# EAGLE design ESP12E BMS (EAGLE 9.6.2)
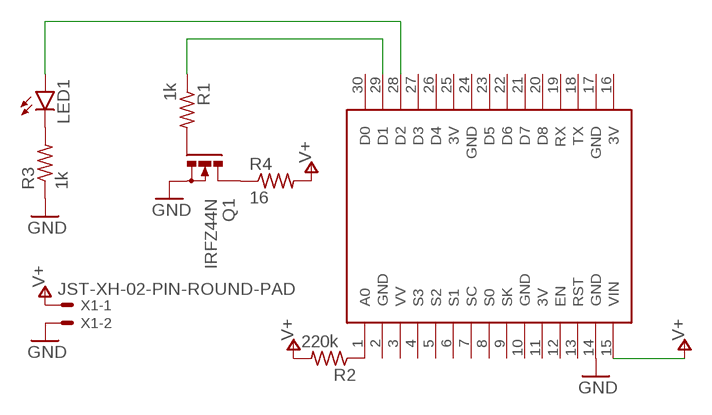
[diagram p0: schematic, sheet 1]

## Parts
LED1  TLLR4400  [LED3MM]
Q1  IRFZ44N  PMOSFET_NTO220BH  [TO220BH]
R1  1k  R-US_0204/7  [0204/7]
R2  220k  R-US_0204/7  [0204/7]
R3  1k  R-US_0204/7  [0204/7]
R4  16  R-US_0613/15  [P0613/15]
U$1  NODEMCU  [NODEMCU]
X1  JST-XH-02-PIN-ROUND-PAD  [JST-XH-02-PACKAGE-ROUND-PAD]

## Nets
GND: Q1.S R3.1 U$1.14(GND) X1.2
N$1: LED1.K(C) R3.2
N$2: Q1.G R1.2
N$3: Q1.D R4.1
N$4: R1.1 U$1.29(D1)
N$5: LED1.A U$1.28(D2)
N$6: R2.1 U$1.1(A0)
V+: R2.2 R4.2 U$1.15(VIN) X1.1
Unconnected: U$1.3(VV) U$1.4(S3) U$1.5(S2) U$1.6(S1) U$1.7(SC) U$1.8(S0) U$1.9(SK) U$1.12(EN) U$1.13(RST) U$1.18(TX) U$1.19(RX) U$1.20(D8) U$1.21(D7) U$1.22(D6) U$1.23(D5) U$1.26(D4) U$1.27(D3) U$1.30(D0)

## Power pins joined to a net without a drawn wire
3V: U$1.11(3V) U$1.16(3V) U$1.25(3V)
GND: U$1.2(GND) U$1.10(GND) U$1.17(GND) U$1.24(GND)

## Library data of the parts
LED1 = led:TLLR4400: Low Current (2mA) LED 3 mm Tinted Diffused Package color RED Source: Data sheet <http://www.farnell.com/datasheets/391100.pdf>; MF: VISHAY SEMICONDUCTOR; OC_FARNELL: 1612437
Q1 = transistor-power:PMOSFET_N: Power MOSFET N-Channel
R1-R4 = rcl:R-US_: RESISTOR, American symbol; SPICEPREFIX: R
U$1 = nodemcu:NODEMCU
X1 = Rembrandt Electronics - JST XH Connectors v1-0:JST-XH-02-PIN: JST XH Connector 2 Pin Wire to board connector. Pitch: 2,54 mm, (0.100") Number of pins: 2 Created by Rembrandt Electronics www.rembrandtelectronics.com

## Board
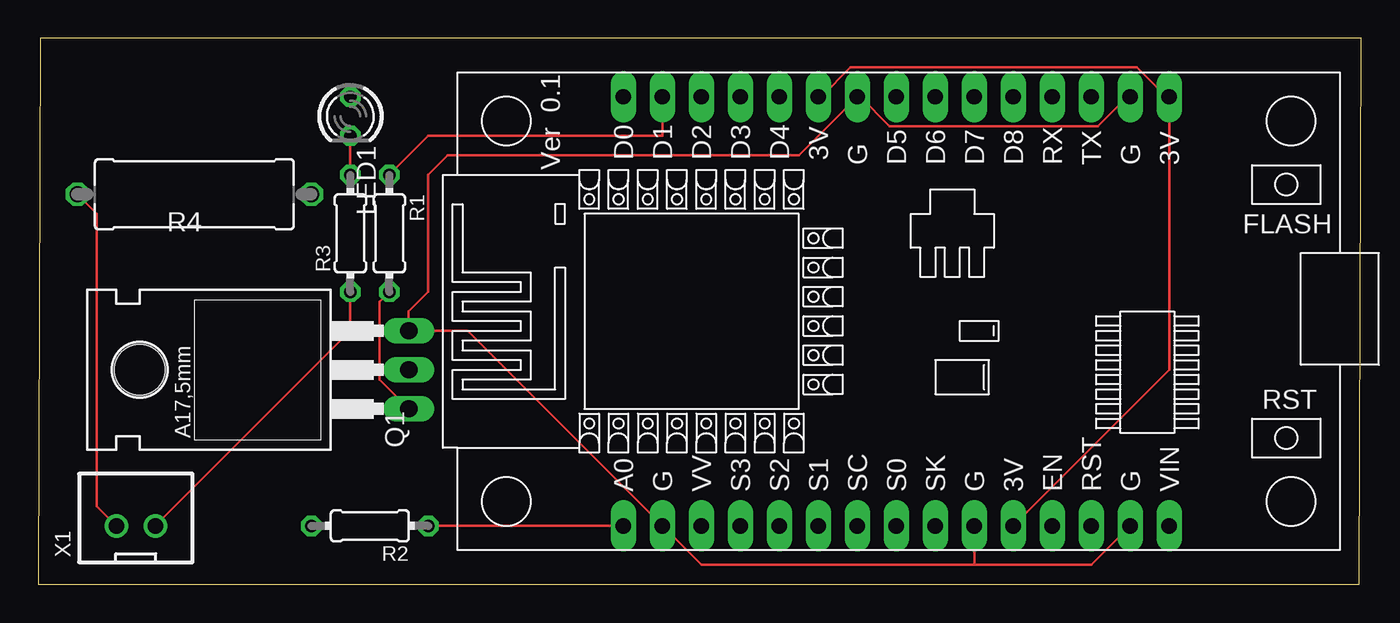
[diagram p1: board, top side]
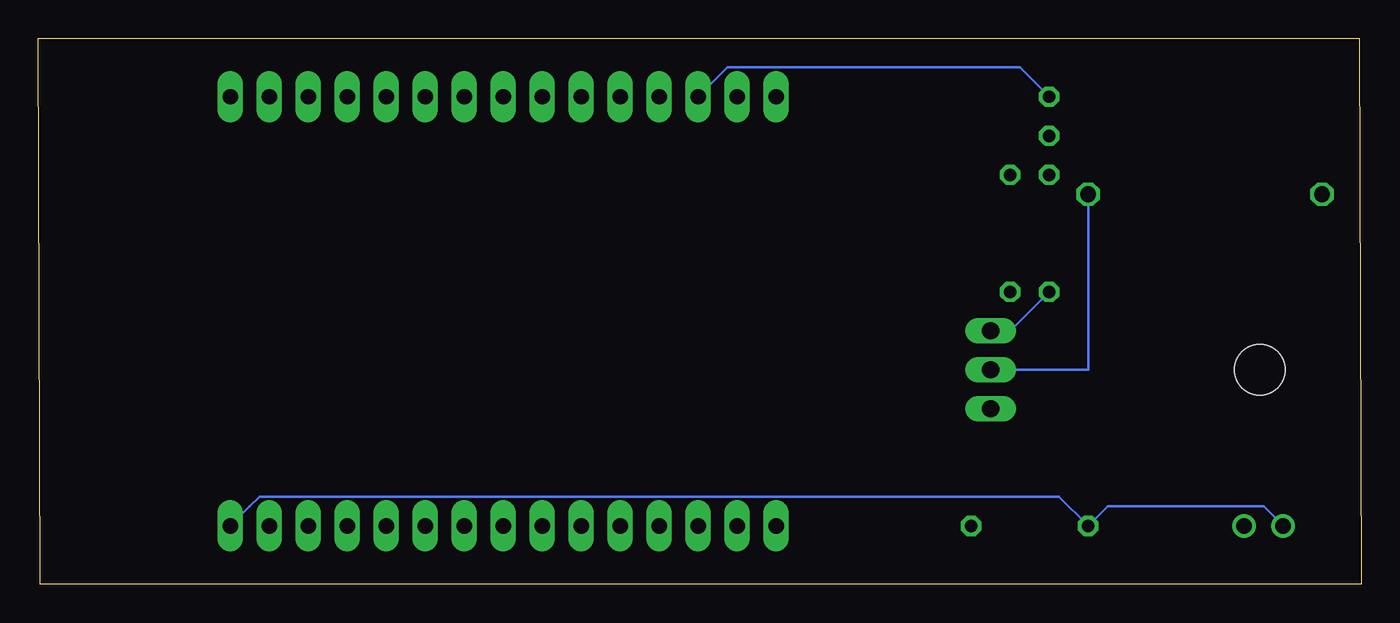
[diagram p2: board, bottom side, seen from below]

Size 86.16 x 35.55 mm. Coordinates in mm from the lower left corner, seen from the top.
Outline: 0,0 86.03,0 86.16,35.55 0.13,35.55 0,0
Copper layers (1*16): Top 0.035mm / dielectric 1.5mm / Bottom 0.035mm
Design rules "default": minimum track width 6mil, minimum drill 0.35mm, track to track 6mil, track to pad 6mil, pad to pad 6mil, via to via 6mil, smd to smd 6mil, copper to edge 40mil, drill to drill 6mil, minimum pad ring 10mil, minimum via ring 8mil, stop-mask expansion 4mil, vias tented up to drill 0mil, thermal gap 10mil

### Footprints (pad centres in the part's own frame; a part is rotated, then mirrored left to right if it is on the bottom)
LED3MM = drill 0.813 octagon: A -1.27,0; K 1.27,0
TO220BH = drill 1.118 long: D 0,-6.35; G -2.54,-6.35; S 2.54,-6.35 | hole 3.302: 0,11.176
0204/7 = drill 0.813 octagon: 1 -3.81,0; 2 3.81,0
P0613/15 = drill 1.016 octagon: 1 -7.62,0; 2 7.62,0
NODEMCU = drill 1 pad 1.676 long: 1 -13.97,17.78; 2 -13.97,15.24; 3 -13.97,12.7; 4 -13.97,10.16; 5 -13.97,7.62; 6 -13.97,5.08; 7 -13.97,2.54; 8 -13.97,0; 9 -13.97,-2.54; 10 -13.97,-5.08; 11 -13.97,-7.62; 12 -13.97,-10.16; 13 -13.97,-12.7; 14 -13.97,-15.24; 15 -13.97,-17.78; 16 13.97,-17.78; 17 13.97,-15.24; 18 13.97,-12.7; 19 13.97,-10.16; 20 13.97,-7.62; 21 13.97,-5.08; 22 13.97,-2.54; 23 13.97,0; 24 13.97,2.54; 25 13.97,5.08; 26 13.97,7.62; 27 13.97,10.16; 28 13.97,12.7; 29 13.97,15.24; 30 13.97,17.78
JST-XH-02-PACKAGE-ROUND-PAD = drill 1.016: 1 -1.27,0; 2 1.27,0

### Placement (x,y rotation side)
LED1  20.32,30.48 270 top
Q1  17.78,13.97 90 top
R1  22.86,22.86 270 top
R2  21.59,3.81 180 top
R3  20.32,22.86 90 top
R4  10.16,25.4 180 top
U$1  55.88,17.78 90 top
X1  6.35,3.81 0 top

### Tracks (layer width: path | path; a pad name or v marks a point on that pad's centre or on a via)
3V
  Top 0.152: U$1.25 50.99,31.75 52.9,33.66 71.56,33.66 73.47,31.75 U$1.16 73.66,13.97 U$1.11
GND
  Top 0.152: X1.2 20.32,16.51 R3.1 | 60.96,1.27 43.18,1.27 U$1.2 27.94,16.51 Q1.S 24.13,17.78 25.4,19.05 25.4,26.67 26.67,27.94 49.53,27.94 U$1.24 53.53,31.75 55.44,29.84 69.02,29.84 70.93,31.75 U$1.17 | U$1.10 60.96,1.27 | 60.96,1.27 68.58,1.27 U$1.14
  Bottom 0.152: R3.1 22.86,16.51 Q1.S
N$1
  Top 0.152: LED1.K R3.2
N$2
  Top 0.152: R1.2 22.23,18.41 22.23,13.34 Q1.G
N$3
  Bottom 0.152: R4.1 17.78,13.97 Q1.D
N$4
  Top 0.152: R1.1 25.4,29.21 40.64,29.21 U$1.29
N$5
  Bottom 0.152: LED1.A 22.23,33.66 41.27,33.66 U$1.28
N$6
  Top 0.152: U$1.1 R2.1
V+
  Top 0.152: R4.2 3.81,24.13 3.81,5.08 X1.1
  Bottom 0.152: X1.1 6.35,5.08 16.51,5.08 R2.2 19.69,5.71 71.75,5.71 72.39,5.08 U$1.15